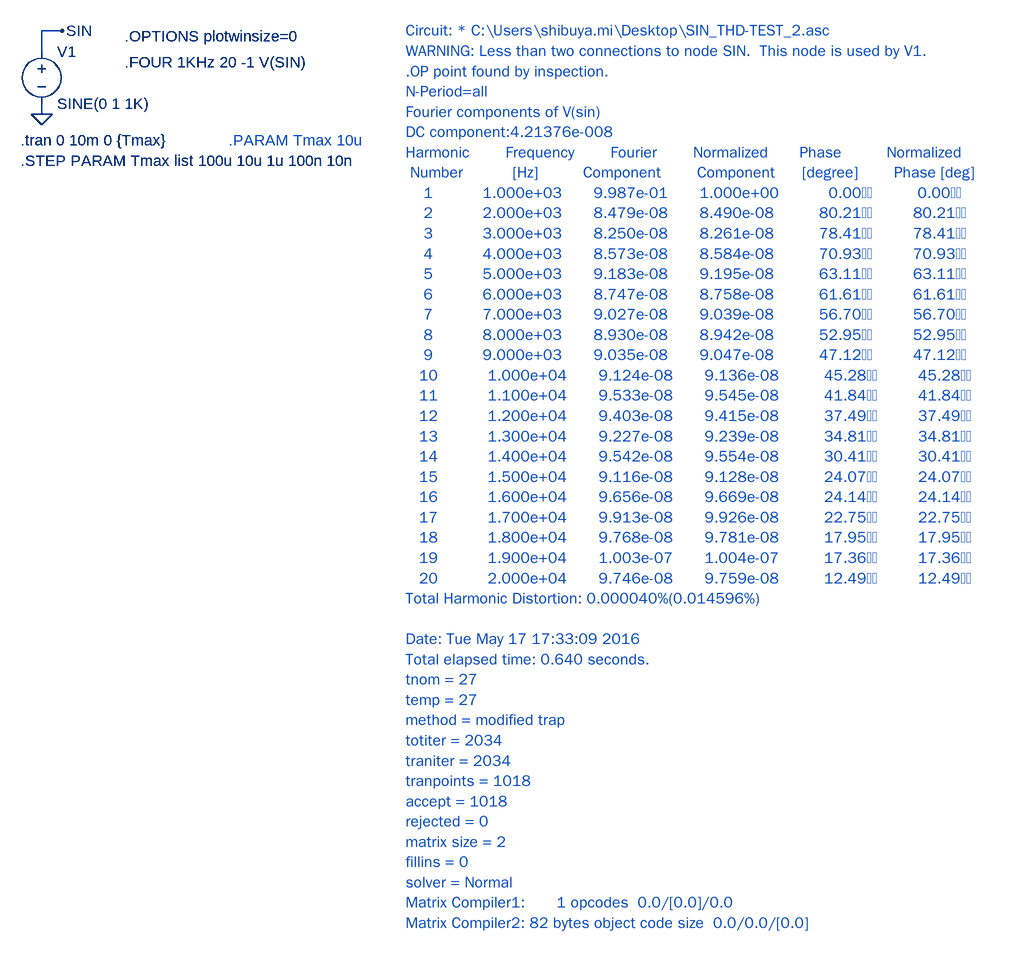
[diagram p0: schematic Fig_2-35_SIN_THD-TEST_2.asc]
Fig_2-35_SIN_THD-TEST_2.asc, the LTspice schematic file:
Version 4
SHEET 1 1712 1316
WIRE 64 80 32 80
WIRE 32 112 32 80
WIRE 32 208 32 192
FLAG 32 208 0
FLAG 64 80 SIN
SYMBOL voltage 32 96 R0
WINDOW 123 0 0 Left 2
WINDOW 39 0 0 Left 2
SYMATTR InstName V1
SYMATTR Value SINE(0 1 1K)
TEXT 0 248 Left 2 !.tran 0 10m 0 {Tmax}
TEXT 0 280 Left 2 !.STEP PARAM Tmax list 100u 10u 1u 100n 10n
TEXT 160 88 Left 2 !.OPTIONS plotwinsize=0
TEXT 160 128 Left 2 !.FOUR 1KHz 20 -1 V(SIN)
TEXT 320 248 Left 2 ;.PARAM Tmax 10u
TEXT 592 80 Left 2 ;Circuit: * C:\\Users\\shibuya.mi\\Desktop\\SIN_THD-TEST_2.asc\nWARNING: Less than two connections to node SIN.  This node is used by V1.\n.OP point found by inspection.\nN-Period=all\nFourier components of V(sin)\nDC component:4.21376e-008\nHarmonic        Frequency        Fourier        Normalized       Phase          Normalized\n Number           [Hz]          Component        Component      [degree]        Phase [deg]\n    1           1.000e+03       9.987e-01       1.000e+00           0.00�‹          0.00�‹\n    2           2.000e+03       8.479e-08       8.490e-08          80.21�‹         80.21�‹\n    3           3.000e+03       8.250e-08       8.261e-08          78.41�‹         78.41�‹\n    4           4.000e+03       8.573e-08       8.584e-08          70.93�‹         70.93�‹\n    5           5.000e+03       9.183e-08       9.195e-08          63.11�‹         63.11�‹\n    6           6.000e+03       8.747e-08       8.758e-08          61.61�‹         61.61�‹\n    7           7.000e+03       9.027e-08       9.039e-08          56.70�‹         56.70�‹\n    8           8.000e+03       8.930e-08       8.942e-08          52.95�‹         52.95�‹\n    9           9.000e+03       9.035e-08       9.047e-08          47.12�‹         47.12�‹\n   10           1.000e+04       9.124e-08       9.136e-08          45.28�‹         45.28�‹\n   11           1.100e+04       9.533e-08       9.545e-08          41.84�‹         41.84�‹\n   12           1.200e+04       9.403e-08       9.415e-08          37.49�‹         37.49�‹\n   13           1.300e+04       9.227e-08       9.239e-08          34.81�‹         34.81�‹\n   14           1.400e+04       9.542e-08       9.554e-08          30.41�‹         30.41�‹\n   15           1.500e+04       9.116e-08       9.128e-08          24.07�‹         24.07�‹\n   16           1.600e+04       9.656e-08       9.669e-08          24.14�‹         24.14�‹\n   17           1.700e+04       9.913e-08       9.926e-08          22.75�‹         22.75�‹\n   18           1.800e+04       9.768e-08       9.781e-08          17.95�‹         17.95�‹\n   19           1.900e+04       1.003e-07       1.004e-07          17.36�‹         17.36�‹\n   20           2.000e+04       9.746e-08       9.759e-08          12.49�‹         12.49�‹\nTotal Harmonic Distortion: 0.000040%(0.014596%)\n\nDate: Tue May 17 17:33:09 2016\nTotal elapsed time: 0.640 seconds.\ntnom = 27\ntemp = 27\nmethod = modified trap\ntotiter = 2034\ntraniter = 2034\ntranpoints = 1018\naccept = 1018\nrejected = 0\nmatrix size = 2\nfillins = 0\nsolver = Normal\nMatrix Compiler1:       1 opcodes  0.0/[0.0]/0.0\nMatrix Compiler2: 82 bytes object code size  0.0/0.0/[0.0]

The netlist it stands for:
* Fig_2-35_SIN_THD-TEST_2.asc
V1 SIN 0 SINE(0 1 1K)
.tran 0 10m 0 {Tmax}
.STEP PARAM Tmax list 100u 10u 1u 100n 10n
.OPTIONS plotwinsize=0
.FOUR 1KHz 20 -1 V(SIN)
* .PARAM Tmax 10u
* Circuit: * C:\Users\shibuya.mi\Desktop\SIN_THD-TEST_2.asc
* WARNING: Less than two connections to node SIN.  This node is used by V1.
* .OP point found by inspection.
* N-Period=all
* Fourier components of V(sin)
* DC component:4.21376e-008
* Harmonic        Frequency        Fourier        Normalized       Phase          Normalized
*  Number           [Hz]          Component        Component      [degree]        Phase [deg]
*     1           1.000e+03       9.987e-01       1.000e+00           0.00�‹          0.00�‹
*     2           2.000e+03       8.479e-08       8.490e-08          80.21�‹         80.21�‹
*     3           3.000e+03       8.250e-08       8.261e-08          78.41�‹         78.41�‹
*     4           4.000e+03       8.573e-08       8.584e-08          70.93�‹         70.93�‹
*     5           5.000e+03       9.183e-08       9.195e-08          63.11�‹         63.11�‹
*     6           6.000e+03       8.747e-08       8.758e-08          61.61�‹         61.61�‹
*     7           7.000e+03       9.027e-08       9.039e-08          56.70�‹         56.70�‹
*     8           8.000e+03       8.930e-08       8.942e-08          52.95�‹         52.95�‹
*     9           9.000e+03       9.035e-08       9.047e-08          47.12�‹         47.12�‹
*    10           1.000e+04       9.124e-08       9.136e-08          45.28�‹         45.28�‹
*    11           1.100e+04       9.533e-08       9.545e-08          41.84�‹         41.84�‹
*    12           1.200e+04       9.403e-08       9.415e-08          37.49�‹         37.49�‹
*    13           1.300e+04       9.227e-08       9.239e-08          34.81�‹         34.81�‹
*    14           1.400e+04       9.542e-08       9.554e-08          30.41�‹         30.41�‹
*    15           1.500e+04       9.116e-08       9.128e-08          24.07�‹         24.07�‹
*    16           1.600e+04       9.656e-08       9.669e-08          24.14�‹         24.14�‹
*    17           1.700e+04       9.913e-08       9.926e-08          22.75�‹         22.75�‹
*    18           1.800e+04       9.768e-08       9.781e-08          17.95�‹         17.95�‹
*    19           1.900e+04       1.003e-07       1.004e-07          17.36�‹         17.36�‹
*    20           2.000e+04       9.746e-08       9.759e-08          12.49�‹         12.49�‹
* Total Harmonic Distortion: 0.000040%(0.014596%)
* Date: Tue May 17 17:33:09 2016
* Total elapsed time: 0.640 seconds.
* tnom = 27
* temp = 27
* method = modified trap
* totiter = 2034
* traniter = 2034
* tranpoints = 1018
* accept = 1018
* rejected = 0
* matrix size = 2
* fillins = 0
* solver = Normal
* Matrix Compiler1:       1 opcodes  0.0/[0.0]/0.0
* Matrix Compiler2: 82 bytes object code size  0.0/0.0/[0.0]
.backanno
.end